# EasyEDA Pro project ProPrj_屏幕挂灯_2025-11-13.epro

# Schematic Schematic1
Board Name: Board1; Create Date: 2025-10-27; Page Name: P1; Project Name: 屏幕挂灯; Schematic Name: Schematic1; Update Date: 2025-11-10; Company: 嘉立创EDA; Page Size: A4; Version: V1.0
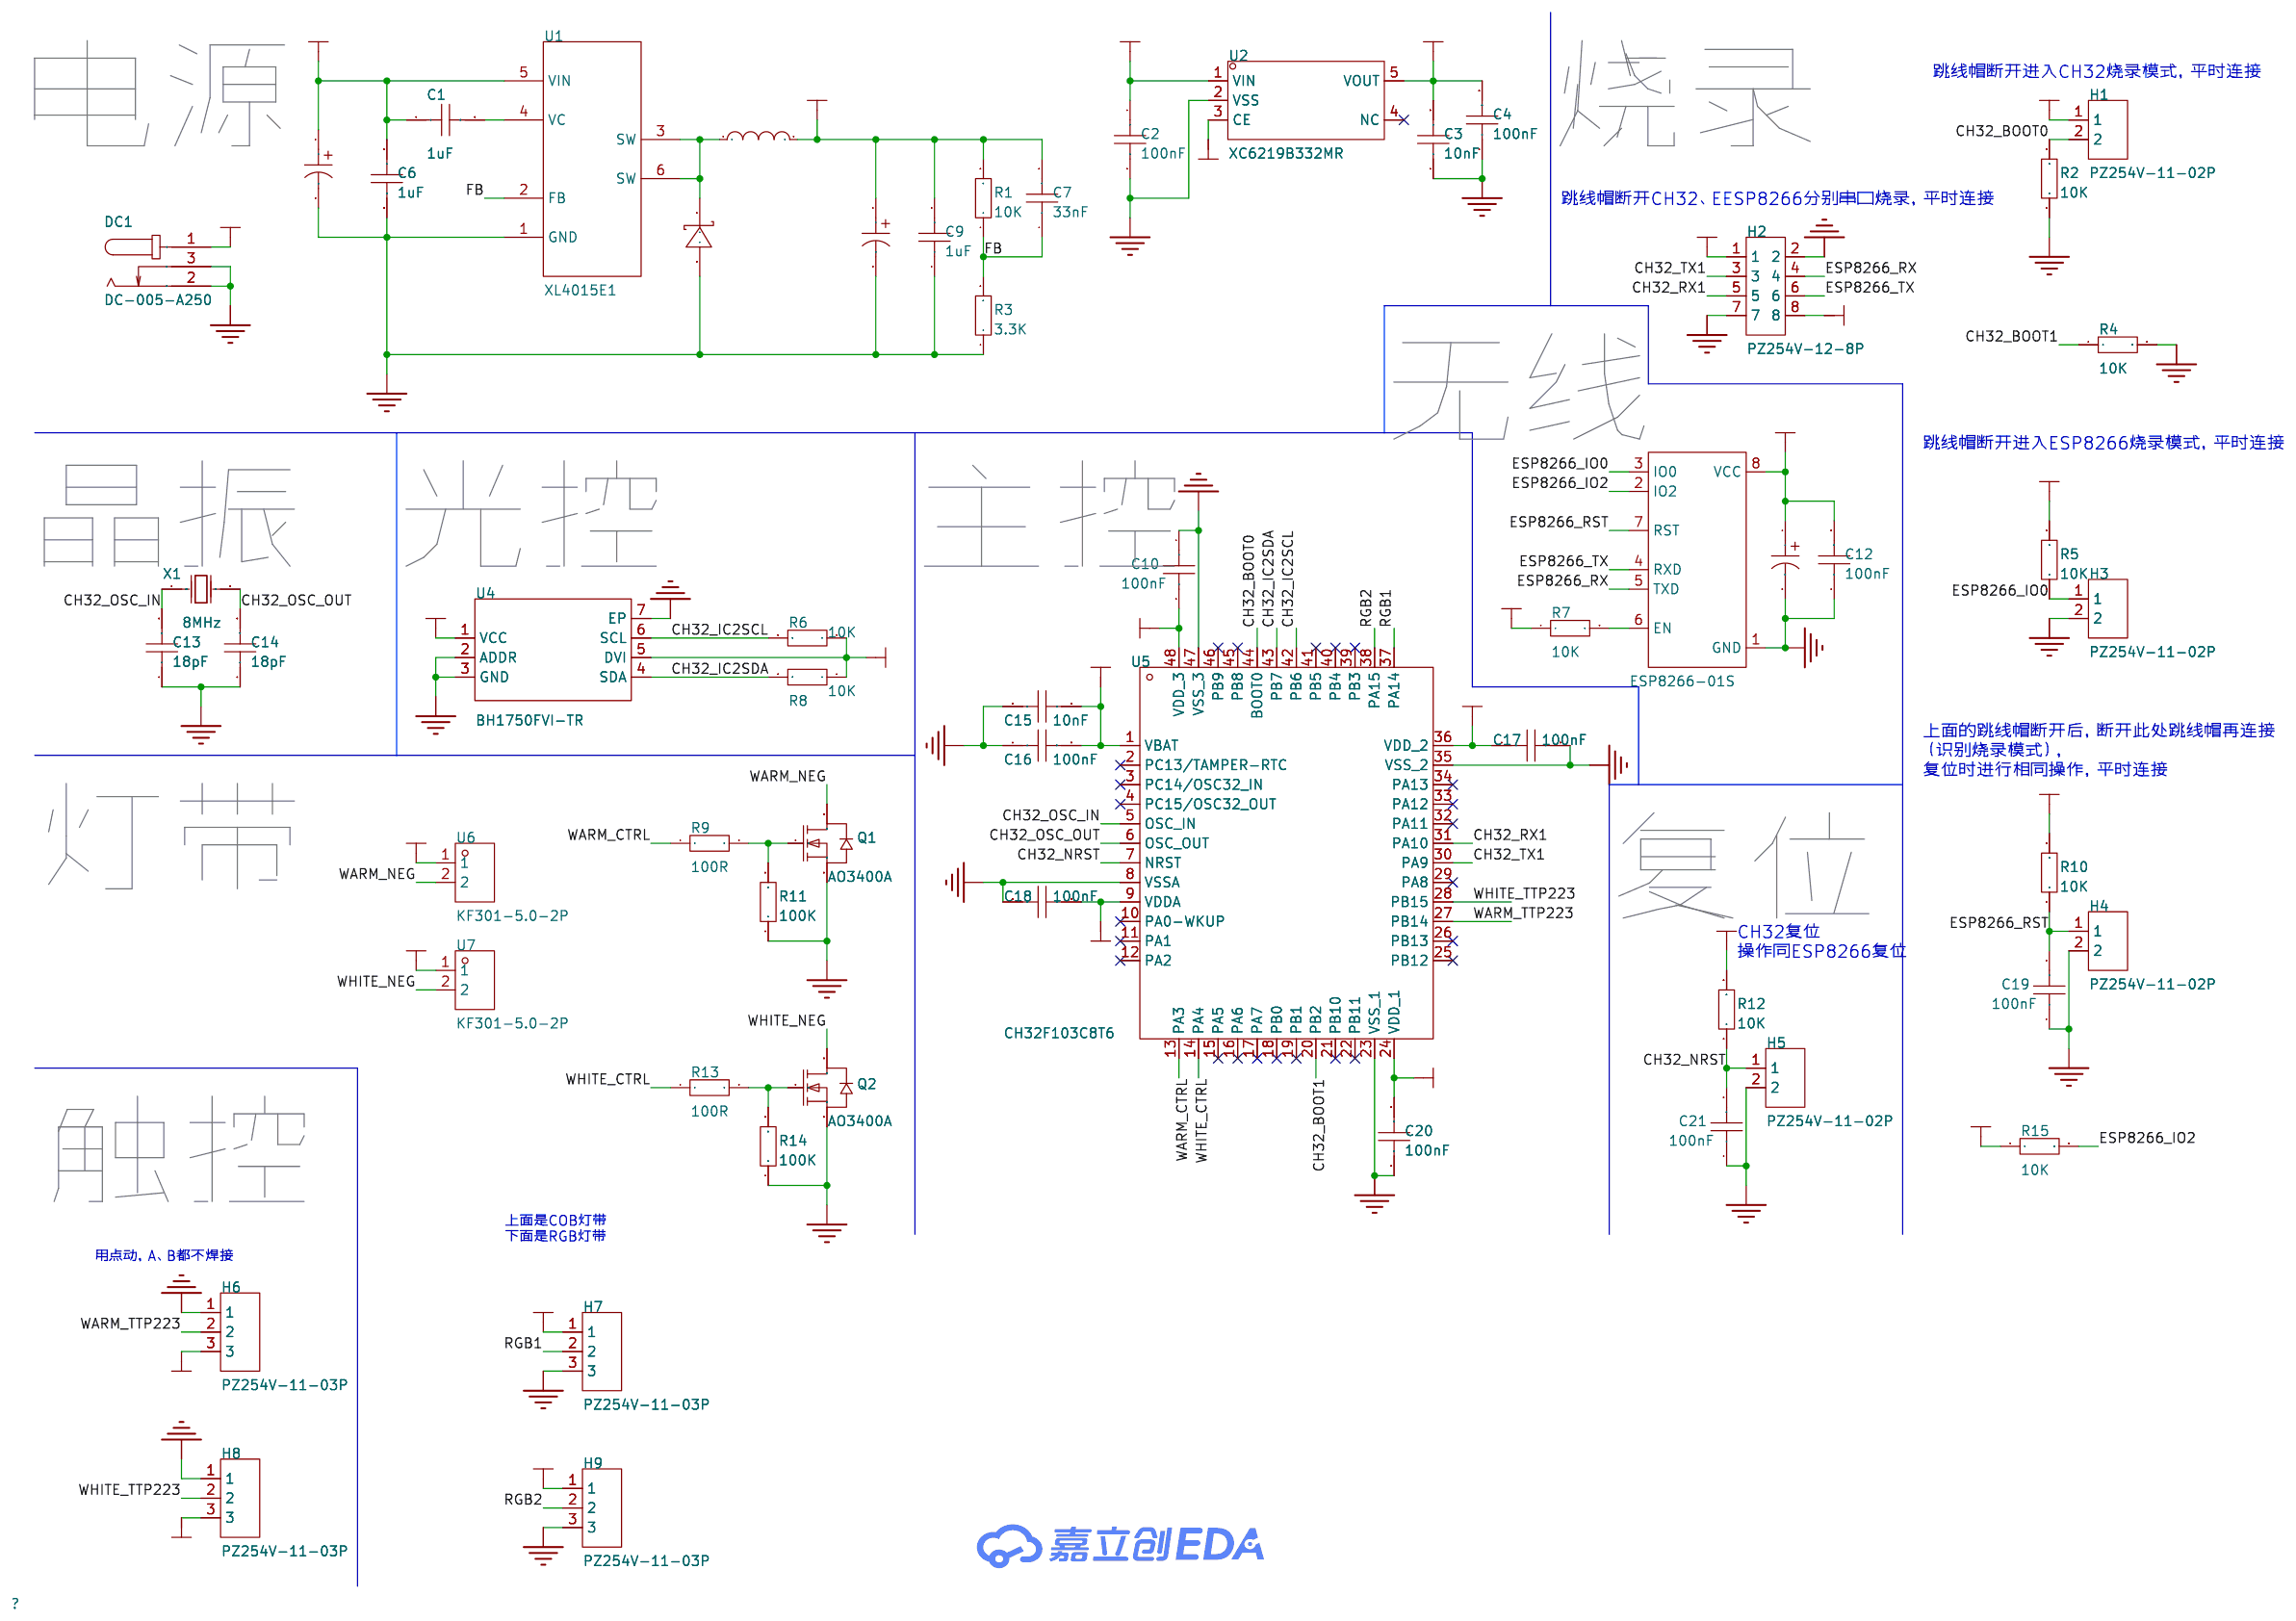
[diagram p0: schematic sheet]

## Parts
C1  1uF  [C0805]
C2  100nF  [C0603]
C3  10nF  [C0603]
C4  100nF  [C0603]
C5  220uF  [贴片铝电解电容220uF_35V_8*10.5mm]
C6  1uF  [C0805]
C7  33nF  [C0805]
C8  470uF  [贴片铝电解电容470uF_10V_6.3*7.7mm]
C9  1uF  [C0805]
C10  100nF  [C0603]
C11  100uF  [贴片铝电解电容100uF_10V_5*5.4mm]
C12  100nF  [C0603]
C13  18pF  [C0603]
C14  18pF  [C0603]
C15  10nF  [C0603]
C16  100nF  [C0603]
C17  100nF  [C0603]
C18  100nF  [C0603]
C19  100nF  [C0603]
C20  100nF  [C0603]
C21  100nF  [C0603]
D1  SS54  [SS54SMB40V5AD0-214]
DC1  DC-005-A250  [DC-IN-TH_DC-005-A250]
H1  PZ254V-11-02P  [HDR-TH_2P-P2.54-V-M]
H2  PZ254V-12-8P  [HDR-TH_8P-P2.54-V-M-R2-C4-S2.54]
H3  PZ254V-11-02P  [HDR-TH_2P-P2.54-V-M]
H4  PZ254V-11-02P  [HDR-TH_2P-P2.54-V-M]
H5  PZ254V-11-02P  [HDR-TH_2P-P2.54-V-M]
H6  PZ254V-11-03P  [HDR-TH_3P-P2.54-V-M]
H7  PZ254V-11-03P  [HDR-TH_3P-P2.54-V-M]
H8  PZ254V-11-03P  [HDR-TH_3P-P2.54-V-M]
H9  PZ254V-11-03P  [HDR-TH_3P-P2.54-V-M]
L1  68uH  [65125铁硅铝电感/68uH(1.0线)]
Q1  AO3400A  [SOT-23-3_L2.9-W1.3-P1.90-LS2.4-BR]
Q2  AO3400A  [SOT-23-3_L2.9-W1.3-P1.90-LS2.4-BR]
R1  10K  [R0805]
R2  10K  [R0603]
R3  3.3K  [R0805]
R4  10K  [R0603]
R5  10K  [R0603]
R6  10K  [R0603]
R7  10K  [R0603]
R8  10K  [R0603]
R9  100R  [R0603]
R10  10K  [R0603]
R11  100K  [R0603]
R12  10K  [R0603]
R13  100R  [R0603]
R14  100K  [R0603]
R15  10K  [R0603]
U1  XL4015E1  [TO-263-5_L10.2-W8.9-P1.70-TL]
U2  XC6219B332MR  [SOT-23-5_L3.0-W1.7-P0.95-LS2.8-BR]
U3  ESP8266-01S  [WIFIM-TH_ESP8266-01S]
U4  BH1750FVI-TR  [WSOF-6_L2.6-W1.6-P0.50-TL-EP]
U5  CH32F103C8T6  [LQFP-48_L7.0-W7.0-P0.50-LS9.0-BL]
U6  KF301-5.0-2P  [CONN-TH_P5.00_KF301-5.0-2P]
U7  KF301-5.0-2P  [CONN-TH_P5.00_KF301-5.0-2P]
X1  8MHz  [CRYSTAL-SMD_L5.0-W3.2]

## Library data of the parts
C1 C6 C7 C9 = CAP_0805: Supplier Footprint: 0805
C2-C4 C10 C12-C21 = CAP_0603: Supplier Footprint: 0603
C5 = 贴片铝电解电容220uF_35V_8*10.5mm: 淘宝深圳市优信电子科技有限公司购买
C8 = 贴片铝电解电容470uF_10V_6.3*7.7mm: 淘宝深圳市优信电子科技有限公司购买
C11 = 贴片铝电解电容100uF_10V_5*5.4mm: 淘宝深圳市优信电子科技有限公司购买
D1 = SS54SMB40V5AD0-214: 淘宝优信电子购买
DC1 = DC-005-A250: 连接器类型:DC电源插座;安装方式:弯插;触点内径:2.5mm;触点外径:6.3mm;额定电流:3A;额定电压:30V;工作温度范围:-20℃~+70℃;; LCSC Part Name: DC电源插座 内径:2.5mm 外径:6.3mm; Supplier Part: C720558; Manufacturer: XUNPU(讯普); Supplier Footprint: 插件; JLCPCB Part Class: Extended Part; Datasheet: https://atta.szlcsc.com/upload/public/pdf/source/20220428/F133011953B124341225656709BD6AA6.pdf; Supplier: LCSC; Connector Type: DC电源插座; Mounting Style: 弯插; Inside Contact Diameter: 2.5mm; Outside Contact Diameter: 6.3mm; Current Rating (Max): 3A; Voltage Rating (Max): 30V; Operating Temperature Range: -20℃~+70℃
H1 H3-H5 = PZ254V-11-02P: 插针结构:1x2P;间距:2.54mm;行距:-;圆针/方针:方针;安装方式:直插;排数:单排;总PIN位数:2P;额定电流:-;额定电压:-;配合针长度:6mm;塑高:2.5mm;端接针长度:3mm;触头材质:黄铜;触头镀层:-;工作温度:-40℃~+105℃;颜色:黑色;; LCSC Part Name: 1x2P 间距:2.54mm 方针 直插; Supplier Part: C492401; Manufacturer: XFCN(兴飞); Supplier Footprint: 插件,P=2.54mm; JLCPCB Part Class: 扩展库; Datasheet: https://item.szlcsc.com/datasheet/PZ254V-11-02P/502957.html; Supplier: LCSC; Pin Structure: 1x2P; Pitch: 2.54mm; Circluar Pins/Square Pins: 方针; Mounting Type: 直插; Number of Rows: 单排; Number of Pins: 2P; Length of Mating Pin: 6mm; Insulation Height: 2.5mm; Length of End Connection Pin: 3mm; Contact Material: 黄铜; Operating Temperature: -40℃~+105℃; Color: 黑色
H2 = PZ254V-12-8P: 插针结构:2x4P;间距:2.54mm;行距:2.54mm;圆针/方针:方针;安装方式:直插;排数:双排;总PIN位数:8P;额定电流:-;额定电压:-;配合针长度:6mm;塑高:2.5mm;端接针长度:3mm;触头材质:黄铜;触头镀层:-;工作温度:-40℃~+105℃;颜色:黑色;; LCSC Part Name: 2x4P 间距:2.54mm 方针 直插; Supplier Part: C492421; Manufacturer: XFCN(兴飞); Supplier Footprint: 插件,P=2.54mm; JLCPCB Part Class: 扩展库; Datasheet: https://item.szlcsc.com/datasheet/PZ254V-12-8P/502977.html; Supplier: LCSC; Pin Structure: 2x4P; Pitch: 2.54mm; Row Spacing: 2.54mm; Circluar Pins/Square Pins: 方针; Mounting Type: 直插; Number of Rows: 双排; Number of Pins: 8P; Length of Mating Pin: 6mm; Insulation Height: 2.5mm; Length of End Connection Pin: 3mm; Contact Material: 黄铜; Operating Temperature: -40℃~+105℃; Color: 黑色
H6-H9 = PZ254V-11-03P: 插针结构:1x3P;间距:2.54mm;行距:-;圆针/方针:方针;安装方式:直插;排数:单排;总PIN位数:3P;额定电流:3A;额定电压:250V;配合针长度:6mm;塑高:2.5mm;端接针长度:3mm;工作温度:-40℃~+105℃;颜色:黑色;; LCSC Part Name: 1x3P 间距:2.54mm 方针 直插; Supplier Part: C2937625; Manufacturer: XFCN(兴飞); Supplier Footprint: 插件,P=2.54mm; JLCPCB Part Class: 扩展库; Datasheet: https://item.szlcsc.com/datasheet/PZ254V-11-03P/3293280.html; Supplier: LCSC; Pin Structure: 1x3P; Pitch: 2.54mm; Circluar Pins/Square Pins: 方针; Mounting Type: 直插; Number of Rows: 单排; Number of Pins: 3P; Current Rating: 3A; Voltage Rating (Max): 250V; Length of Mating Pin: 6mm; Insulation Height: 2.5mm; Length of End Connection Pin: 3mm; Operating Temperature: -40℃~+105℃; Color: 黑色
L1 = 65125铁硅铝电感/68uH(1.0线): 淘宝优信电子购买
Q1 Q2 = AO3400A_C347475: 数量:1个N沟道;漏源电压(Vdss):30V;连续漏极电流(Id):5.8A;导通电阻(RDS(on)):17mΩ@10V;耗散功率(Pd):1.4W;阈值电压(Vgs(th)):1.1V@250uA;; LCSC Part Name: 1个N沟道 耐压:30V 电流:5.8A; Supplier Part: C347475; Manufacturer: UMW(友台半导体); Supplier Footprint: SOT-23; JLCPCB Part Class: 扩展库; Datasheet: https://item.szlcsc.com/datasheet/AO3400A/324135.html; Supplier: LCSC; Number: 1个N沟道; Drain to Source Voltage: 30V; Current - Continuous Drain(Id): 5.8A; RDS(on): 17mΩ@10V; Pd - Power Dissipation: 1.4W; Gate Threshold Voltage (Vgs(th)): 1.1V@250uA; Gate Charge(Qg): 9.7nC@4.5V; Input Capacitance(Ciss): 823pF; Reverse Transfer Capacitance (Crss@Vds): 77pF; Operating Temperature: -55℃~+150℃; Output Capacitance(Coss): 99pF
R1 R3 = Res_0805: Supplier Footprint: 0805
R2 R4-R15 = Res_0603: Supplier Footprint: 0603
U1 = XL4015E1: 功能类型:降压型;工作电压:8V~36V;输出电压:1.25V~32V;输出电流:5A;输出类型:可调;; LCSC Part Name: 5A 180KHz 36V 降压型DC-DC转换器; Supplier Part: C51661; Manufacturer: XLSEMI(芯龙); Supplier Footprint: TO-263-5; JLCPCB Part Class: Extended Part; Datasheet: https://item.szlcsc.com/datasheet/XL4015E1/52674.html; Supplier: LCSC; Function: 降压型; Voltage - Supply: 8V~36V; Output Voltage: 1.25V~32V; Output Current: 5A; Frequency - Switching: 180kHz; Operating Temperature: -40℃~+125℃; Synchronous Rectifier: 否; Number of Outputs: 1; Topology: 降压式; Quiescent Current: 5mA; Switch tube (built-in/external): 内置; Output Type: 可调
U2 = XC6219B332MR_C347386: 输出类型:固定;工作电压:7V;输出电压:3.3V;输出电流:300mA;电源纹波抑制比(PSRR):40dB@(1kHz);输出极性:正极;; LCSC Part Name: 输入7V 输出3.3V 300mA; Supplier Part: C347386; Manufacturer: UMW(友台半导体); Supplier Footprint: SOT-23-5; JLCPCB Part Class: Extended Part; Datasheet: https://item.szlcsc.com/datasheet/XC6219B332MR/324046.html; Supplier: LCSC; Output Type: 固定; Voltage - Supply: 7V; Output Voltage: 3.3V; Output Current: 300mA; Power Supply Rejection Ratio (PSRR): 40dB@(1kHz); Voltage Dropout: 280mV@(100mA); standby current: 15uA; Features: 过流保护；带使能；短路保护; Operating Temperature: -20℃~+60℃; Output Configuration: 正极; Number of Outputs: 1
U3 = ESP8266-01S: Supplier Part: C9900150497; Supplier Footprint: TH-8P; JLCPCB Part Class: 扩展库; Supplier: LCSC
U4 = BH1750FVI-TR: 检测颜色:-;接口类型:I2C;; Supplier Part: C78960; Manufacturer: ROHM(罗姆); Supplier Footprint: WSOF-6; JLCPCB Part Class: 扩展库; Datasheet: https://item.szlcsc.com/datasheet/BH1750FVI-TR/80097.html; Supplier: LCSC; Interface: I2C; Voltage - Supply: 2.4V~3.6V; Operating Temperature: -40℃~+85℃
U5 = CH32F103C8T6: CPU内核:ARM-M3;程序存储容量:64KB;RAM总容量:20KB;GPIO端口数量:37;工作电压范围:2.7V~5.5V;CPU最大主频:72MHz;程序存储器类型:-;应用领域:-;; Supplier Part: C2687451; Manufacturer: WCH(南京沁恒); Supplier Footprint: LQFP-48(7x7); JLCPCB Part Class: 扩展库; Datasheet: https://atta.szlcsc.com/upload/public/pdf/source/20240313/BE468ED4036D9C136F63688DBA40783D.pdf; Supplier: LCSC; CPU Core: ARM-M3; Program Storage Size: 64KB; RAM Size: 20KB; GPIO Ports Number: 37; Operating Voltage Range: 2.7V~5.5V; CPU Maximum Speed: 72MHz; Operating Temperature Range: -40℃~+85℃; ADC (Bit): 12bit; DAC (Bit): 12bit; CAN: 1; UART/USART: 3; I2C: 2; SPI: 2; Universal Serial Bus: 有
U6 U7 = KF301-5.0-2P: 结构:1x2P;间距:5mm;颜色:蓝色;安装方式:直插;额定电流:17A;额定电压:250V;排数:1;线规 - AWG:14~22;线规 - 平方毫米:1.5;每排PIN数:2;工作温度范围:-30℃~+120℃;; LCSC Part Name: 5mm 1x2P 排数:1 每排P数:2 直插; Supplier Part: C474881; Manufacturer: KEFA(科发); Supplier Footprint: 插件,P=5mm; JLCPCB Part Class: 扩展库; Datasheet: https://atta.szlcsc.com/upload/public/pdf/source/20230317/03A5B5FC229D6F9225E8F51DA1A4E80A.pdf; Supplier: LCSC; Structure: 1x2P; Pitch: 5mm; Color: 蓝色; Mounting Style: 直插; Current Rating (Max): 17A; Voltage Rating (Max): 250V; Number of Pins: 2P; Number of Rows: 1; Wire Gauge - AWG: 14~22; Wire Gauge - mm2: 1.5; Number of PINs Per Row: 2; Operating Temperature Range: -30℃~+120℃
X1 = X50328MSB2GI: 晶振类型:贴片晶振;频率:8MHz;常温频差:±10ppm;负载电容:20pF;频率稳定度:±20ppm;; LCSC Part Name: YSX530GA 8MHZ 2P 5032 20PF ±10PPM -40~85℃ (±20PPM); Supplier Part: C115962; Manufacturer: YXC(扬兴晶振); Supplier Footprint: SMD5032-2P; JLCPCB Part Class: Basic Part; Datasheet: https://item.szlcsc.com/datasheet/X50328MSB2GI/117214.html; Supplier: LCSC; Type: 贴片晶振; Normal temperature Frequency Tolerance: ±10ppm; Load Capacitance: 20pF; Frequency Stability: ±20ppm; Operating Temperature: -40℃~+85℃

## Nets
3.3V: C3.2 C4.2 C10.2 C11.1 C12.2 C15.2 C16.2 C17.1 C18.2 C20.2 H1.1 H2.1 H2.8 H6.3 H8.3 R5.2 R6.1 R7.1 R8.1 R10.2 R12.2 R15.1 U2.5(VOUT) U3.8(VCC) U4.1(VCC) U4.5(DVI) U5.1(VBAT) U5.9(VDDA) U5.24(VDD_1) U5.36(VDD_2) U5.48(VDD_3)
5V: C2.1 C7.2 C8.1 C9.2 H7.1 H9.1 L1.2 R1.2 U2.1(VIN) U2.3(CE)
24V: C1.1 C5.1 C6.1 DC1.1 U1.5(VIN) U6.1 U7.1
GND: C2.2 C3.1 C4.1 C5.2 C6.2 C8.2 C9.1 C10.1 C11.2 C12.1 C13.1 C14.1 C15.1 C16.1 C17.2 C18.1 C19.1 C20.1 C21.1 D1.2(A) DC1.2 DC1.3 H2.2 H2.7 H3.2 H4.2 H5.2 H6.1 H7.3 H8.1 H9.3 Q1.2(S) Q2.2(S) R2.1 R3.1 R4.2 R11.1 R14.1 U1.1(GND) U2.2(VSS) U3.1(GND) U4.2(ADDR) U4.3(GND) U4.7(EP) U5.8(VSSA) U5.23(VSS_1) U5.35(VSS_2) U5.47(VSS_3)
CH32_BOOT0: H1.2 R2.2 U5.44(BOOT0)
CH32_BOOT1: R4.1 U5.20(PB2)
CH32_IC2SCL: R6.2 U4.6(SCL) U5.42(PB6)
CH32_IC2SDA: R8.2 U4.4(SDA) U5.43(PB7)
CH32_NRST: C21.2 H5.1 R12.1 U5.7(NRST)
CH32_OSC_IN: C13.2 U5.5(OSC_IN) X1.1(OSC1)
CH32_OSC_OUT: C14.2 U5.6(OSC_OUT) X1.2(OSC2)
CH32_RX1: H2.5 U5.31(PA10)
CH32_TX1: H2.3 U5.30(PA9)
ESP8266_IO0: H3.1 R5.1 U3.3(IO0)
ESP8266_IO2: R15.2 U3.2(IO2)
ESP8266_RST: C19.2 H4.1 R10.1 U3.7(RST)
ESP8266_RX: H2.4 U3.5(TXD)
ESP8266_TX: H2.6 U3.4(RXD)
FB: C7.1 R1.1 R3.2 U1.2(FB)
RGB1: H7.2 U5.37(PA14)
RGB2: H9.2 U5.38(PA15)
WARM_CTRL: R9.1 U5.13(PA3)
WARM_NEG: Q1.3(D) U6.2
WARM_TTP223: H6.2 U5.27(PB14)
WHITE_CTRL: R13.1 U5.14(PA4)
WHITE_NEG: Q2.3(D) U7.2
WHITE_TTP223: H8.2 U5.28(PB15)
$1N4877: Q1.1(G) R9.2 R11.2
$1N4909: Q2.1(G) R13.2 R14.2
$1N16163: C1.2 U1.4(VC)
$1N16167: D1.1(K) L1.1 U1.3(SW) U1.6(SW)
$1N18355: R7.2 U3.6(EN)

Not connected (* = marked no-connect by the designer): U2 4(NC)*; U5 2(PC13/TAMPER-RTC)* 3(PC14/OSC32_IN)* 4(PC15/OSC32_OUT)* 10(PA0-WKUP)* 11(PA1)* 12(PA2)* 15(PA5)* 16(PA6)* 17(PA7)* 18(PB0)* 19(PB1)* 21(PB10)* 22(PB11)* 25(PB12)* 26(PB13)* 29(PA8)* 32(PA11)* 33(PA12)* 34(PA13)* 39(PB3)* 40(PB4)* 41(PB5)* 45(PB8)* 46(PB9)*

## Notes on the sheet
- 跳线帽断开进入CH32烧录模式，平时连接
- 电源
- 烧录
- 跳线帽断开CH32、EESP8266分别串口烧录，平时连接
- 无线
- 跳线帽断开进入ESP8266烧录模式，平时连接
- 晶振
- 光控
- 主控
- 上面的跳线帽断开后，断开此处跳线帽再连接
  （识别烧录模式），
  复位时进行相同操作，平时连接
- 灯带
- 复位
- CH32复位
  操作同ESP8266复位
- 触控
- 上面是COB灯带
  下面是RGB灯带
- 用点动，A、B都不焊接

# Board PCB1
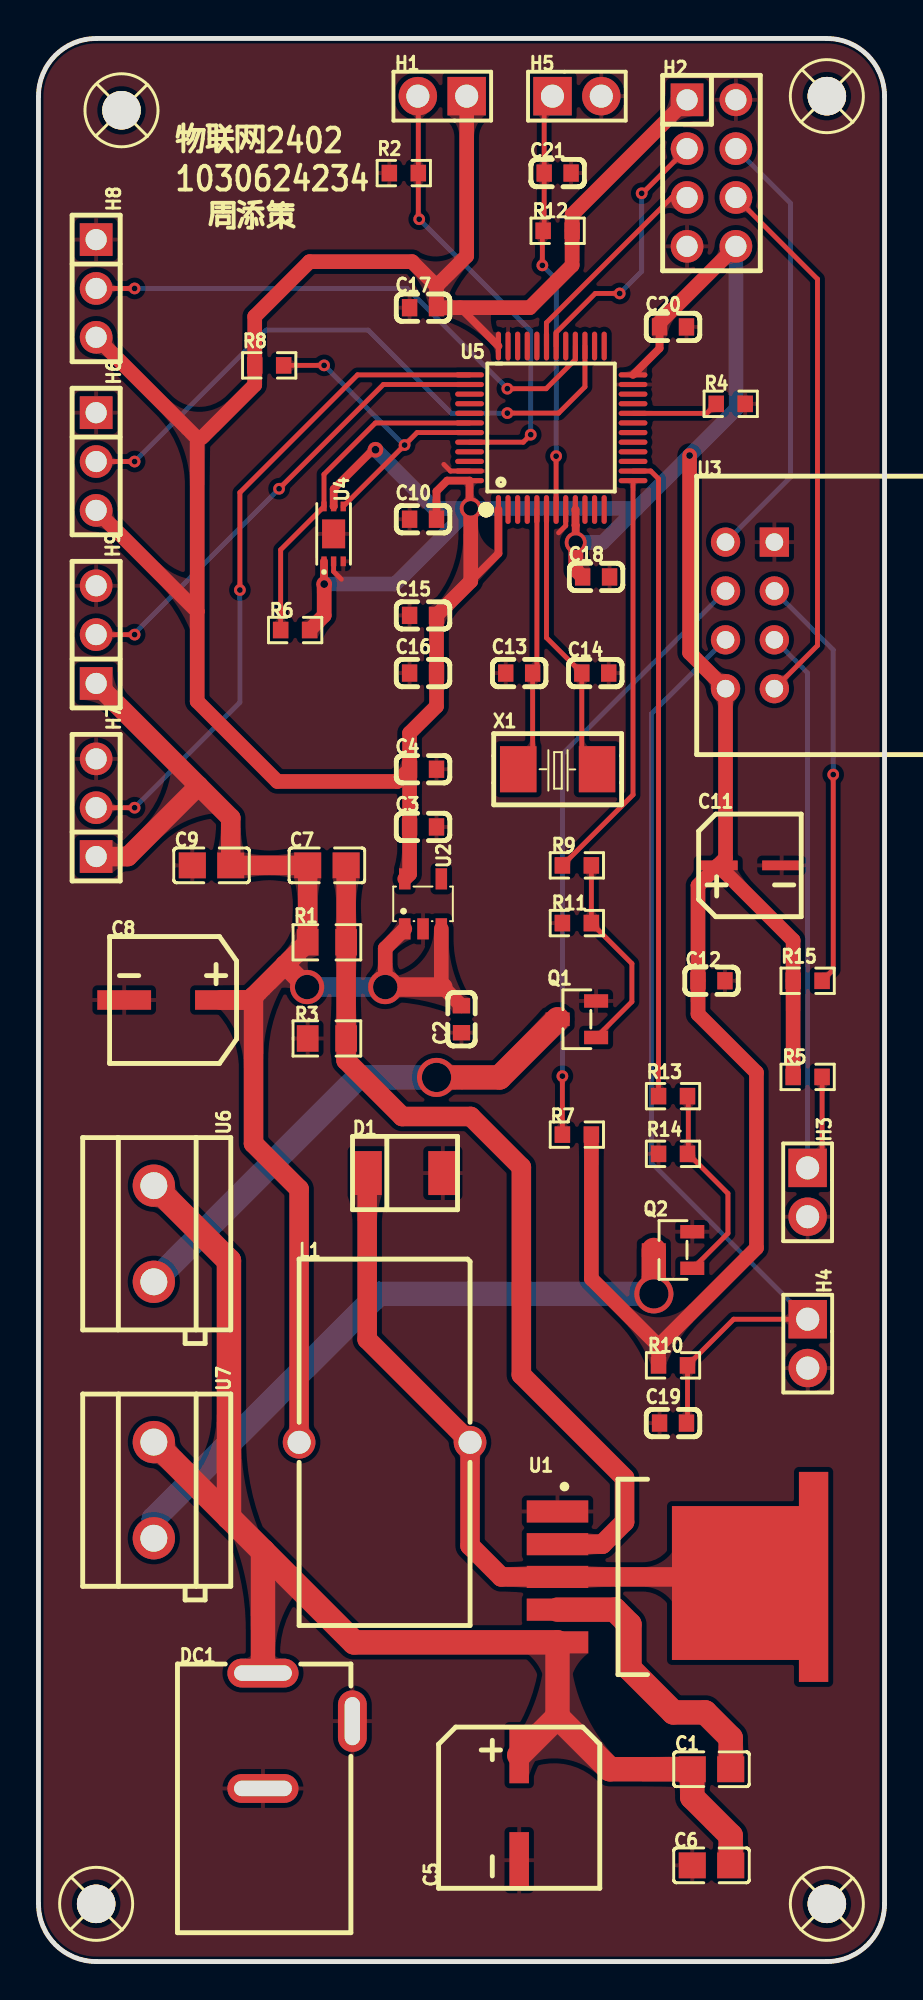
[diagram p1: board, top side]
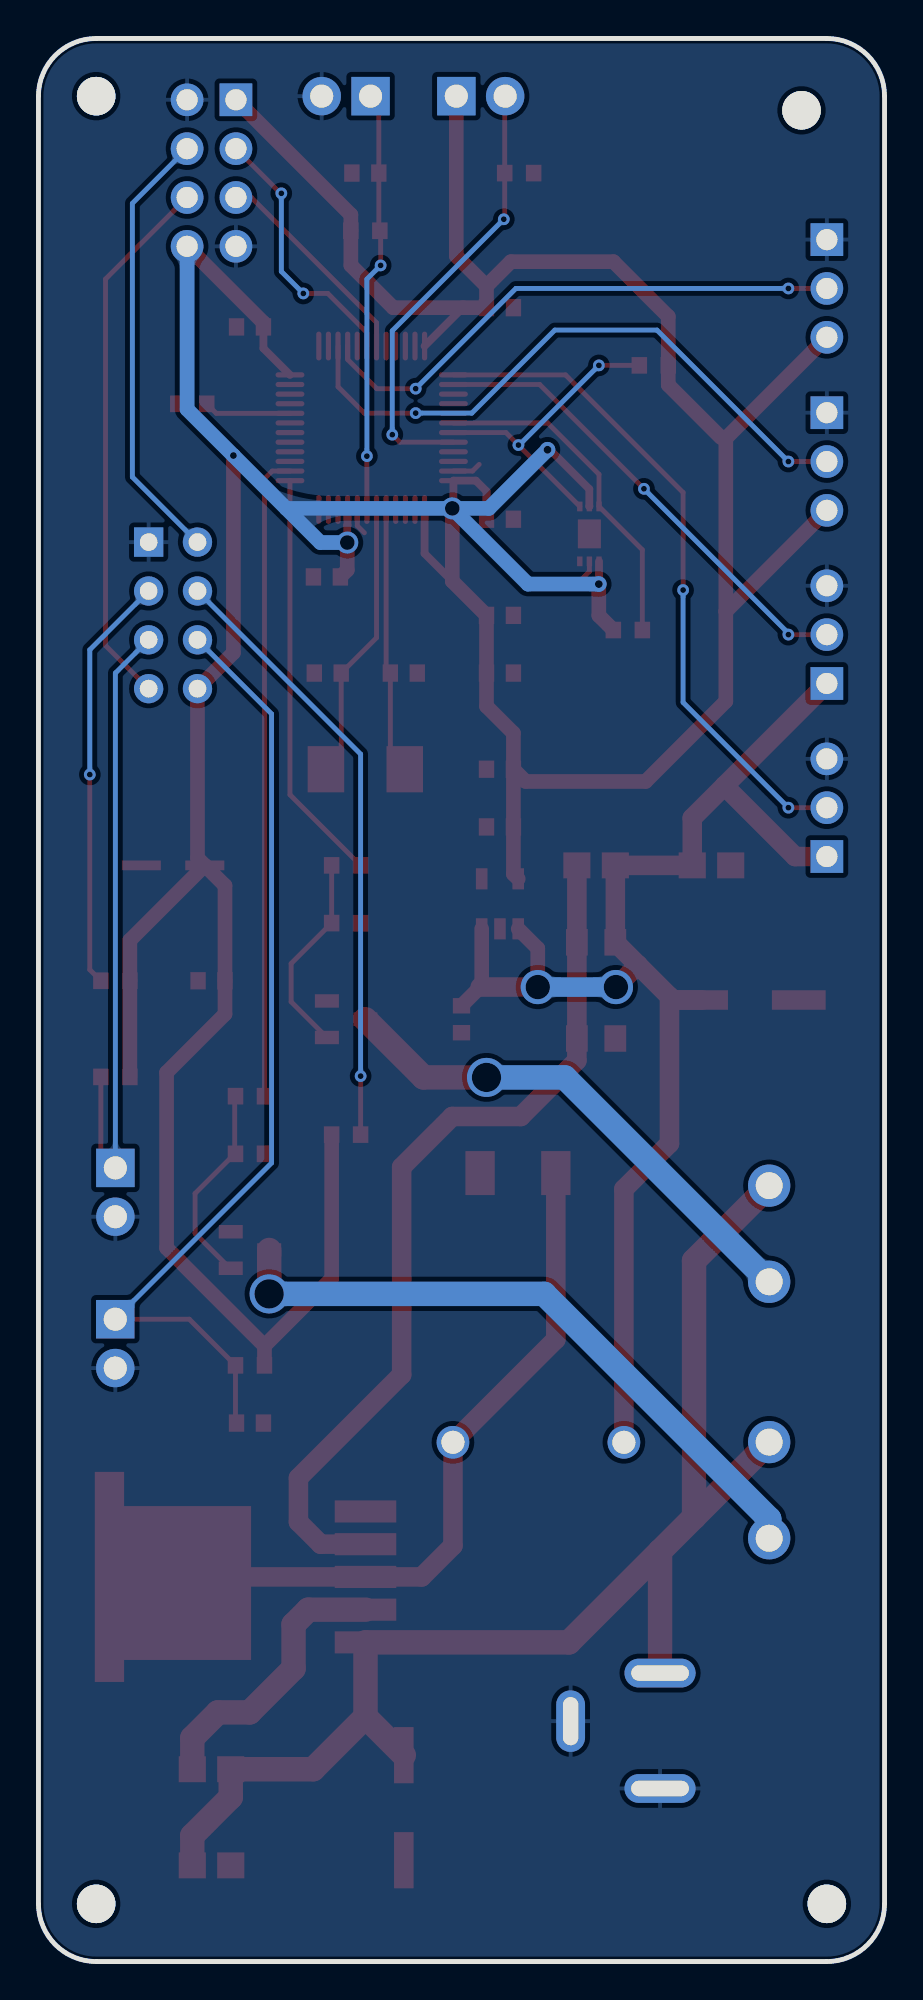
[diagram p2: board, bottom side, seen from below]

Outline 44 x 100 mm; copper layers: Top Layer, Bottom Layer. Coordinates in mm from the lower left corner of the outline.
Outline path: 0,97 0,3 arc(0.88,0.88) 3,0 41,0 arc(43.12,0.88) 44,3 44,97 arc(43.12,99.12) 41,100 3,100 arc(0.88,99.12) 0,97
Stack: Top Layer 0.035mm / Dielectric1 1.51mm FR4 er 4.5 / Bottom Layer 0.035mm

## Design rules (mm)
template: JLCPCB Capability(Two Layers Board)
spacing copperThickness1oz (default): track to track 0.102, other pairs 0.152 to 0.3
spacing copperThickness2oz: track to track 0.203, other pairs 0.152 to 0.3
track width copperThickness1oz (default): min 0.127, default 0.254, max 2.54
track width copperThickness2oz: min 0.203, default 0.254, max 2.54
differential pair differentialPair (default): width min 0.127, default 0.254, max 2.54; gap min 0.152, default 0.152
via viaSize (default): diameter min 0.5, default 0.61, max 10; hole min 0.3, default 0.305, max 6.3

## Placement (name value [footprint] x y rotation side)
C1  1uF  [C0805]  35 10 0 top
C2  100nF  [C0603]  22 49 270 top
C3  10nF  [C0603]  20 59 180 top
C4  100nF  [C0603]  20 62 180 top
C5  220uF  [贴片铝电解电容220uF_35V_8*10.5mm]  25 8 270 top
C6  1uF  [C0805]  35 5 180 top
C7  33nF  [C0805]  15 57 180 top
C8  470uF  [贴片铝电解电容470uF_10V_6.3*7.7mm]  7 50 180 top
C9  1uF  [C0805]  9 57 0 top
C10  100nF  [C0603]  20 75 0 top
C11  100uF  [贴片铝电解电容100uF_10V_5*5.4mm]  37 57 0 top
C12  100nF  [C0603]  35 51 180 top
C13  18pF  [C0603]  25 67 0 top
C14  18pF  [C0603]  28.96 67 180 top
C15  10nF  [C0603]  20 70 0 top
C16  100nF  [C0603]  20 67 0 top
C17  100nF  [C0603]  20 86 180 top
C18  100nF  [C0603]  29 72 180 top
C19  100nF  [C0603]  33 28 0 top
C20  100nF  [C0603]  33 85 180 top
C21  100nF  [C0603]  27 93 180 top
D1  SS54  [SS54SMB40V5AD0-214]  19 41 0 top
DC1  DC-005-A250  [DC-IN-TH_DC-005-A250]  14 12 90 top
H1  PZ254V-11-02P  [HDR-TH_2P-P2.54-V-M]  21 97 180 top
H2  PZ254V-12-8P  [HDR-TH_8P-P2.54-V-M-R2-C4-S2.54]  35 93 270 top
H3  PZ254V-11-02P  [HDR-TH_2P-P2.54-V-M]  40 40 270 top
H4  PZ254V-11-02P  [HDR-TH_2P-P2.54-V-M]  40 32.13 270 top
H5  PZ254V-11-02P  [HDR-TH_2P-P2.54-V-M]  28 97 0 top
H6  PZ254V-11-03P  [HDR-TH_3P-P2.54-V-M]  3 78 270 top
H7  PZ254V-11-03P  [HDR-TH_3P-P2.54-V-M]  3 60 90 top
H8  PZ254V-11-03P  [HDR-TH_3P-P2.54-V-M]  3 87 270 top
H9  PZ254V-11-03P  [HDR-TH_3P-P2.54-V-M]  3 69 90 top
L1  68uH  [65125铁硅铝电感/68uH(1.0线)]  18 27 180 top
Q1  AO3400A  [SOT-23-3_L2.9-W1.3-P1.90-LS2.4-BR]  28 49 0 top
Q2  AO3400A  [SOT-23-3_L2.9-W1.3-P1.90-LS2.4-BR]  33 37 0 top
R1  10K  [R0805]  15 53 180 top
R2  10K  [R0603]  19 93 0 top
R3  3.3K  [R0805]  15 48 0 top
R4  10K  [R0603]  36 81 0 top
R5  10K  [R0603]  40 46 180 top
R6  10K  [R0603]  13.35 69.24 180 top
R7  10K  [R0603]  28 43 180 top
R8  10K  [R0603]  12 83 0 top
R9  100R  [R0603]  28 57 0 top
R10  10K  [R0603]  33 31 180 top
R11  100K  [R0603]  28 54 0 top
R12  10K  [R0603]  27 90 0 top
R13  100R  [R0603]  33 45 0 top
R14  100K  [R0603]  33 42 0 top
R15  10K  [R0603]  40 51 0 top
SCREW1  -  [M2螺丝]  3 3 0 top
SCREW2  -  [M2螺丝]  41 3 0 top
SCREW3  -  [M2螺丝]  41 97 0 top
SCREW4  -  [M2螺丝]  4.32 96.27 0 top
U1  XL4015E1  [TO-263-5_L10.2-W8.9-P1.70-TL]  32 20 0 top
U2  XC6219B332MR  [SOT-23-5_L3.0-W1.7-P0.95-LS2.8-BR]  20 55 270 top
U3  ESP8266-01S  [WIFIM-TH_ESP8266-01S]  37 70 270 top
U4  BH1750FVI-TR  [WSOF-6_L2.6-W1.6-P0.50-TL-EP]  15.35 74.24 90 top
U5  CH32F103C8T6  [LQFP-48_L7.0-W7.0-P0.50-LS9.0-BL]  26.67 79.76 0 top
U6  KF301-5.0-2P  [CONN-TH_P5.00_KF301-5.0-2P]  6 37.85 270 top
U7  KF301-5.0-2P  [CONN-TH_P5.00_KF301-5.0-2P]  6 24.51 270 top
X1  8MHz  [CRYSTAL-SMD_L5.0-W3.2]  27 62 0 top

## Footprints (pads in the part's own frame, mm; a bottom-side part is the same pattern mirrored in y, then rotated)
65125铁硅铝电感/68uH(1.0线)
  round 1.7 hole 1.2: 1(-4.445,0) 2(4.445,0)
C0603
  rect 0.8x0.9 smd: 1(-0.7,0) 2(0.7,0)
C0805
  rect 1.41x1.35 smd: 1(-1,0) 2(1,0)
CONN-TH_P5.00_KF301-5.0-2P
  round 2.2 hole 1.4: 1(-2.5,0) 2(2.5,0)
CRYSTAL-SMD_L5.0-W3.2
  rect 1.9x2.4 smd: 1(-2.05,0) 2(2.05,0)
DC-IN-TH_DC-005-A250
  oval 1.5x3.7 hole 0.8x3: 1(3,2.325) 2(-3,2.325)
  oval 3.2x1.5 hole 2.5x0.8: 3(0.5,-2.325)
HDR-TH_2P-P2.54-V-M
  rect 2x2 hole 1.2: 1(-1.27,0)
  round 2 hole 1.2: 2(1.27,0)
HDR-TH_3P-P2.54-V-M
  rect 1.7x1.7 hole 1.1: 1(-2.54,0)
  round 1.7 hole 1.1: 2(0,0) 3(2.54,0)
HDR-TH_8P-P2.54-V-M-R2-C4-S2.54
  rect 1.7x1.7 hole 1.1: 1(-3.81,-1.27)
  round 1.7 hole 1.1: 2(-3.81,1.27) 3(-1.27,-1.27) 4(-1.27,1.27) 5(1.27,-1.27) 6(1.27,1.27) 7(3.81,-1.27) 8(3.81,1.27)
LQFP-48_L7.0-W7.0-P0.50-LS9.0-BL
  oval 0.27x1.5 smd: 1(-2.75,-4.25) 2(-2.25,-4.25) 3(-1.75,-4.25) 4(-1.25,-4.25) 5(-0.75,-4.25) 6(-0.25,-4.25) 7(0.25,-4.25) 8(0.75,-4.25) 9(1.25,-4.25) 10(1.75,-4.25) 11(2.25,-4.25) 12(2.75,-4.25) 25(2.75,4.25) 26(2.25,4.25) 27(1.75,4.25) 28(1.25,4.25) 29(0.75,4.25) 30(0.25,4.25) 31(-0.25,4.25) 32(-0.75,4.25) 33(-1.25,4.25) 34(-1.75,4.25) 35(-2.25,4.25) 36(-2.75,4.25)
  oval 1.5x0.27 smd: 13(4.25,-2.75) 14(4.25,-2.25) 15(4.25,-1.75) 16(4.25,-1.25) 17(4.25,-0.75) 18(4.25,-0.25) 19(4.25,0.25) 20(4.25,0.75) 21(4.25,1.25) 22(4.25,1.75) 23(4.25,2.25) 24(4.25,2.75) 37(-4.25,2.75) 38(-4.25,2.25) 39(-4.25,1.75) 40(-4.25,1.25) 41(-4.25,0.75) 42(-4.25,0.25) 43(-4.25,-0.25) 44(-4.25,-0.75) 45(-4.25,-1.25) 46(-4.25,-1.75) 47(-4.25,-2.25) 48(-4.25,-2.75)
M2螺丝
  round 2 hole 2: 1(0,0)
R0603
  rect 0.806x0.864 smd: 1(-0.753,0) 2(0.753,0)
R0805
  rect 1.133x1.377 smd: 1(-1,0) 2(1,0)
SOT-23-3_L2.9-W1.3-P1.90-LS2.4-BR
  rect 1.25x0.7 smd: 1(1,-0.95) 2(1,0.95) 3(-1,0)
SOT-23-5_L3.0-W1.7-P0.95-LS2.8-BR
  rect 1.1x0.6 smd: 1(1.3,-0.95) 2(1.3,0) 3(1.3,0.95) 4(-1.3,0.95) 5(-1.3,-0.95)
SS54SMB40V5AD0-214
  rect 1.524x2.286 smd: 1(-1.905,0) 2(2.032,0)
TO-263-5_L10.2-W8.9-P1.70-TL
  rect 3.2x1.15 smd: 1(-5.008,3.404) 2(-5.008,1.702) 3(-5.008,0) 4(-5.008,-1.702) 5(-5.008,-3.404)
  custom 8.128x10.922 smd: 6(5.008,-0.318)
WIFIM-TH_ESP8266-01S
  rect 1.524x1.524 hole 0.914: 1(-3.81,1.27)
  round 1.524 hole 0.914: 2(-1.27,1.27) 3(1.27,1.27) 4(3.81,1.27) 5(-3.81,-1.27) 6(-1.27,-1.27) 7(1.27,-1.27) 8(3.81,-1.27)
WSOF-6_L2.6-W1.6-P0.50-TL-EP
  rect 0.505x0.28 smd: 1(-1.427,0.5) 2(-1.427,0) 3(-1.427,-0.5) 4(1.427,-0.5) 5(1.427,0) 6(1.427,0.5)
  rect 1.5x1.2 smd: 7(0,0)
贴片铝电解电容100uF_10V_5*5.4mm
  rect 2.032x0.508 smd: 1(-1.651,0) 2(1.651,0)
贴片铝电解电容220uF_35V_8*10.5mm
  rect 2.921x1.016 smd: 1(-2.731,0) 2(2.731,0)
贴片铝电解电容470uF_10V_6.3*7.7mm
  rect 2.667x1.016 smd: 1(-2.477,0)
  rect 2.794x1.016 smd: 2(2.54,0)

## Nets
As in the schematic.

Pads without a net: SCREW1 1; SCREW2 1; SCREW3 1; SCREW4 1; U2 4; U5 2 3 4 10 11 12 15 16 17 18 19 21 22 25 26 29 32 33 34 39 40 41 45 46

## Via types
v1: diameter 1.778, hole 1.27, Top Layer to Bottom Layer, 2 vias
v2: diameter 1.143, hole 0.762, Top Layer to Bottom Layer, 2 vias
v3: diameter 0.813, hole 0.406, Top Layer to Bottom Layer, 2 vias
v4: diameter 0.711, hole 0.355, Top Layer to Bottom Layer, 1 via
v5: diameter 0.61, hole 0.305, Top Layer to Bottom Layer, 18 vias
v6: diameter 2.032, hole 1.524, Top Layer to Bottom Layer, 2 vias

## Routing (per net, layer and track width the routed paths; a pad name or vN(x,y) marks a point on that pad's centre or on a via; arc(x,y) is an arc through that point)
3.3V: length 264.8
  Top Layer w0.406: v3(17.53,78.61) 17.4,78.61 15.35,76.57 15.35,75.67 U4.5 ; U4.1 14.85,71.64 v3(14.86,71.63) ; 22.48,71.78 23.92,73.22 U5.1 ; U5.24 32.3,83.89 C20.2 ; 21.93,86 U5.36 ; v2(22.48,75.56) 22.42,75.62 U5.48 21.25,77.01 20.7,76.45 C10.2 ; U5.9 27.93,75.5 27.93,74.69 27.94,74.68 v2(27.94,73.79)
  Top Layer w0.762: 32.25,32.02 28.75,35.51 R7.1 ; 32.25,32.02 R10.2 ; 32.25,32.02 37.34,37.11 37.34,46.23 34.3,49.27 C12.2 34.3,55.95 C11.1 ; R5.2 R15.1 39.25,53.1 C11.1 ; H8.3 8.25,79.2 8.25,70.2 ; 8.25,70.2 H6.3 ; 8.25,70.2 8.25,65.53 12.42,61.36 18.66,61.36 C4.2 ; H1.1 22.27,88.69 20.7,87.12 ; C4.2 C3.2 19.3,56.55 U2.5 ; C4.2 19.3,63.88 20.7,65.28 C16.2 C15.2 22.48,71.78 v2(22.48,75.56) ; 20.7,87.12 19.43,88.39 14.1,88.39 11.25,85.54 R8.1 11.25,81.99 8.51,79.25 ; 20.7,87.12 C17.1 25.55,86 27.75,88.21 R12.2 27.75,90.83 H2.1 ; v4(33.86,78.31) 33.86,68.06 U3.8 35.73,57.38 C11.1 ; C20.2 32.3,85.22 H2.8 ; v2(27.94,73.79) 27.94,72.36 C18.2 ; R6.1 14.86,69.99 v3(14.86,71.63)
  Bottom Layer w0.762: v2(22.48,75.56) 20.57,75.56 v3(17.53,78.61) ; v2(22.48,75.56) 31.12,75.56 ; v2(22.48,75.56) 18.54,71.63 v3(14.86,71.63) ; 31.12,75.56 29.34,73.79 v2(27.94,73.79) ; 31.12,75.56 v4(33.86,78.31) 36.27,80.72 H2.8
5V: length 73.7
  Top Layer w0.762: U2.1 18.03,52.68 v1(18.03,50.67) ; U2.3 20.95,50.75 C2.1
  Top Layer w1.016: 12.83,51.83 12.83,51.82 v1(13.97,50.67) ; 12.83,51.83 R1.2 C7.2 C9.2 10,59.46 8.32,61.14 ; 12.83,51.83 11.19,50.19 ; C8.1 11,50 11.19,50.19 ; 8.32,61.14 8.32,61.13 4.65,57.46 H7.1 ; 8.32,61.14 H9.1 ; v1(18.03,50.67) 21.03,50.67 ; 11.19,50.19 11.19,42.54 13.56,40.17 L1.2
  Bottom Layer w1.016: v1(18.03,50.67) v1(13.97,50.67)
24V: length 71.2
  Top Layer w1.27: 11.68,21.34 DC1.1 ; 11.68,21.34 16.41,16.6 U1.5 26.99,12.72 ; 11.68,21.34 9.91,23.1 ; 9.91,23.1 9.91,36.44 U6.1 ; 9.91,23.1 U7.1 ; 26.99,12.72 C5.1 ; 26.99,12.72 29.72,10 C1.1 34,8.54 36,6.54 C6.1
GND: length 3.9
  Top Layer w0.254: U5.8 27.42,74.66 27.05,74.3 ; 15.75,71.88 15.35,72.28 U4.2 ; U5.47 21.43,77.51 21.08,77.85
CH32_BOOT0: length 23.4
  Top Layer w0.254: v5(19.8,90.6) 19.75,90.65 R2.2 19.75,96.98 H1.2 ; U5.44 25.21,79.01 v5(25.6,79.4)
  Bottom Layer w0.254: v5(25.6,79.4) 25.6,84.8 v5(19.8,90.6)
CH32_BOOT1: length 4.5
  Top Layer w0.254: U5.20 34.75,80.51 R4.1
CH32_IC2SCL: length 17.7
  Top Layer w0.254: U5.42 17.52,80.01 14.85,77.33 U4.6 12.6,73.41 R6.2
CH32_IC2SDA: length 16.2
  Top Layer w0.254: U5.43 19.69,79.51 v5(19.04,78.86) U4.4 ; R8.2 v5(14.85,83)
  Bottom Layer w0.254: v5(14.85,83) 19,78.86 v5(19.04,78.86)
CH32_NRST: length 22
  Top Layer w0.254: v5(26.21,88.2) 26.21,89.96 R12.1 26.3,90.05 C21.2 26.3,96.5 26.73,96.93 H5.1 ; v5(26.92,78.28) U5.7
  Bottom Layer w0.254: v5(26.92,78.28) 26.92,87.48 v5(26.21,88.2)
CH32_OSC_IN: length 13.9
  Top Layer w0.254: X1.1 25.7,62.75 C13.2 25.92,67.22 U5.5
CH32_OSC_OUT: length 14.6
  Top Layer w0.254: X1.2 28.26,62.79 C14.2 26.42,68.84 U5.6
CH32_RX1: length 11.2
  Top Layer w0.254: U5.31 26.42,84.01 26.42,85.22 32.93,91.73 H2.5
CH32_TX1: length 13.9
  Top Layer w0.254: v5(30.23,86.74) 28.95,86.74 26.92,84.71 U5.30 ; v5(31.37,91.95) 31.41,91.95 H2.3
  Bottom Layer w0.254: v5(31.37,91.95) 31.37,87.88 v5(30.23,86.74)
ESP8266_IO0: length 33.2
  Top Layer w0.254: H3.1 40.75,42.02 R5.1
  Bottom Layer w0.254: U3.3 40,67 H3.1
ESP8266_IO2: length 21.8
  Top Layer w0.254: v5(41.33,61.72) 41.33,51.58 R15.2
  Bottom Layer w0.254: U3.2 41.33,68.21 v5(41.33,61.72)
ESP8266_RST: length 50.6
  Top Layer w0.254: H4.1 36.15,33.4 R10.1 33.75,28.05 C19.2
  Bottom Layer w0.254: U3.7 31.88,64.88 31.88,41.53 H4.1
ESP8266_RX: length 23
  Bottom Layer w0.254: H2.4 39.12,91.42 39.12,77.2 U3.5
ESP8266_TX: length 28.2
  Top Layer w0.254: U3.4 40.51,68.43 40.51,87.49 H2.6
FB: length 46.2
  Top Layer w1.016: U1.2 29.32,21.7 30.48,22.86 30.48,25.15 25.11,30.51 25.11,41.31 22.48,43.94 18.91,43.94 16,46.86 R3.2 R1.1 C7.1
RGB1: length 35.1
  Top Layer w0.254: v5(10.48,71.32) 10.48,76.39 16.59,82.51 U5.37 ; H7.2 v5(5,60)
  Bottom Layer w0.254: v5(5,60) 10.48,65.48 v5(10.48,71.32)
RGB2: length 24.8
  Top Layer w0.254: H9.2 v5(5,69) ; U5.38 17.94,82.01 v5(12.51,76.58)
  Bottom Layer w0.254: v5(12.51,76.58) 5,69.07 v5(5,69)
WARM_CTRL: length 21.5
  Top Layer w0.254: R9.1 30.92,60.67 U5.13
WARM_NEG: length 26.7
  Top Layer w1.27: v6(20.7,45.97) 23.97,45.97 Q1.3
  Bottom Layer w1.27: v6(20.7,45.97) 16.63,45.97 U6.2
WARM_TTP223: length 32.7
  Top Layer w0.254: v5(24.38,80.52) 27.05,80.52 28.42,81.89 U5.27 ; H6.2 v5(5,78)
  Bottom Layer w0.254: v5(5,78) 11.84,84.84 17.15,84.84 21.46,80.52 v5(24.38,80.52)
WHITE_CTRL: length 33.6
  Top Layer w0.254: U5.14 31.84,77.51 32.25,77.1 R13.1
WHITE_NEG: length 34.1
  Top Layer w1.27: v6(32,34.72) 32,34.72 Q2.3
  Bottom Layer w1.27: U7.2 6,23.02 17.7,34.72 v6(32,34.72)
WHITE_TTP223: length 28.4
  Top Layer w0.254: U5.28 27.92,83.31 26.4,81.79 v5(24.38,81.79) ; H8.2 v5(5,87)
  Bottom Layer w0.254: v5(24.38,81.79) 19.17,87 v5(5,87)
$1N4877: length 10.6
  Top Layer w0.254: Q1.1 30.86,49.91 30.86,51.89 R11.2 R9.2
$1N4909: length 10.6
  Top Layer w0.254: 33.79,45 33.79,42 35.86,39.94 35.86,37.86 34.04,36.05
$1N16163: length 14.7
  Top Layer w1.27: U1.4 29.96,18.3 30.73,17.53 30.73,15.24 33.02,12.95 34.67,12.95 36,11.62 C1.2
$1N16167: length 37
  Top Layer w1.016: U1.6 36.69,20 U1.3 24.07,20 22.44,21.62 L1.1 17.09,32.35 D1.1
$1N18355: length 31.8
  Top Layer w0.254: v5(27.25,46.04) R7.2
  Bottom Layer w0.254: U3.6 27.25,62.79 v5(27.25,46.04)

## Copper pours and planes (outline as drawn; the poured copper is in the pictures)
GND on Top Layer: -1.27,100.71 45.59,100.71 45.59,-0.89 -1.27,-0.89
GND on Bottom Layer: -1.27,100.84 45.21,100.84 45.21,-1.02 -1.27,-1.02

Small or netless copper shapes (teardrops, artwork), in the pictures only: 164 on Top Layer, 40 on Bottom Layer

## Text on the board
Top Silkscreen Layer: 物联网2402 / 1030624234 / 周添策
